# Altium schematic sheet weatherstation.SchDoc: Weather Station
size A4; CheckedBy: rrodrigu; Author: Satxo; CompanyName: Satxo; Revision: 0v1; SheetNumber: 8; SheetTotal: 8; ProjectName: Basestation
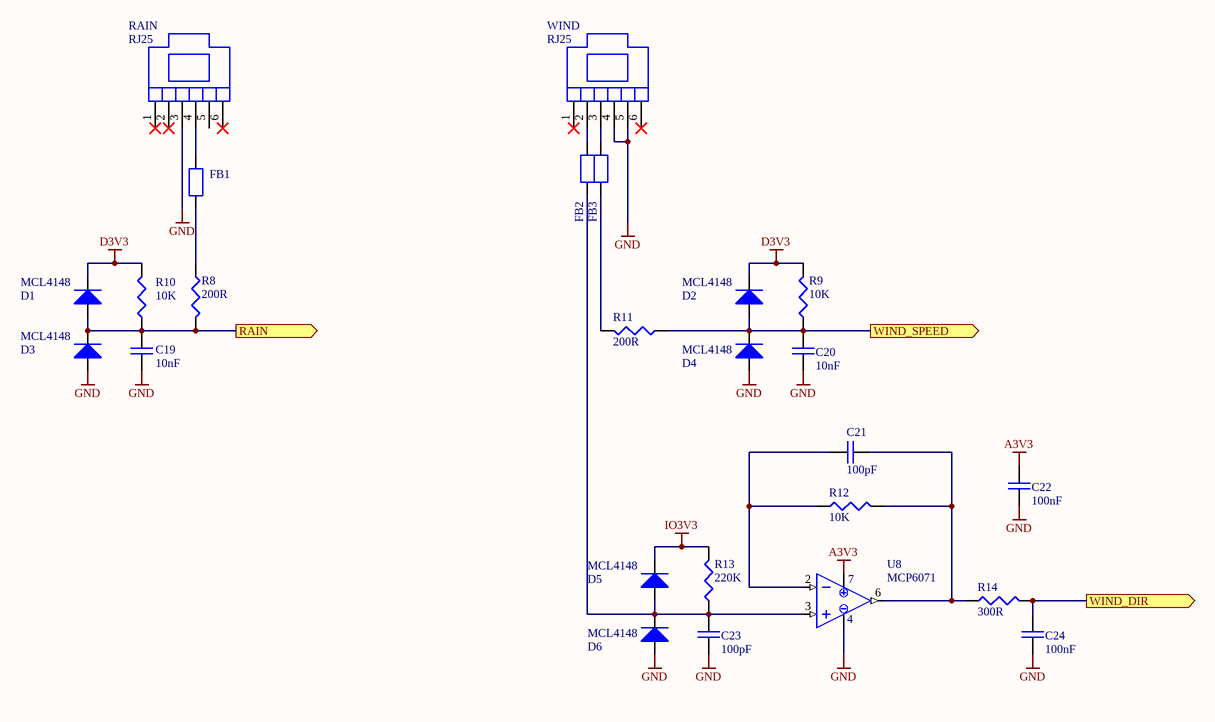
[diagram p0: weatherstation.SchDoc]

## Parts
C19  10nF  [0603]
C20  10nF  [0603]
C21  100pF  [0603]
C22  100nF  [0603]
C23  100pF  [0603]
C24  100nF  [0603]
D1  MCL4148  [0805@DIODE]
D2  MCL4148  [0805@DIODE]
D3  MCL4148  [0805@DIODE]
D4  MCL4148  [0805@DIODE]
D5  MCL4148  [0805@DIODE]
D6  MCL4148  [0805@DIODE]
FB1  150Z_100MHz  [0805]  (value not drawn)
FB2  150Z_100MHz  [0805]  (value not drawn)
FB3  150Z_100MHz  [0805]  (value not drawn)
R8  200R  [0603]
R9  10K  [0603]
R10  10K  [0603]
R11  200R  [0603]
R12  10K  [0603]
R13  220K  [0603]
R14  300R  [0603]
RAIN  RJ25  [RJ25]
U8  MCP6071  [SOIC-8]
WIND  RJ25  [RJ25]

## Ports
RAIN (out), WIND_DIR (out), WIND_SPEED (out)

## Nets
A3V3: C22.2 U8.7(VDD)
D3V3: D1.K D2.K R9.2 R10.2
GND: C19.1 C20.1 C22.1 C23.1 C24.1 D3.A D4.A D6.A RAIN.3 U8.4(VSS) WIND.4 WIND.5
IO3V3: D5.K R13.2
RAIN: C19.2 D1.A D3.K R8.2 R10.1 ; port RAIN
WIND_DIR: C24.2 R14.2 ; port WIND_DIR
WIND_SPEED: C20.2 D2.A D4.K R9.1 R11.1 ; port WIND_SPEED
NetC21_1: C21.1 R12.1 U8.2(INN)
NetC21_2: C21.2 R12.2 R14.1 U8.6(VOUT)
NetC23_2: C23.2 D5.A D6.K FB2.2 R13.1 U8.3(INP)
NetFB1_1: FB1.1 R8.1
NetFB1_2: FB1.2 RAIN.4
NetFB2_1: FB2.1 WIND.2
NetFB3_1: FB3.1 WIND.3
NetFB3_2: FB3.2 R11.2

Not connected (* = marked no-connect by the designer): RAIN 1* 2* 5 6*; WIND 1* 6*

## Notes on the sheet
- Title
- Size:
- Date:
- A4
- Number:
- Time:
- Revision:
- Sheet
- of
- File:

## Library data of the parts
C19-C24 = CAP: Capacitor; Owner: Nuno Brum; Sub-Type: Ceramic; Assembly: INS; Maximum Voltage: *; Creation Date: 2005-04-28; Status: Valid; Validation date: 2006-05-15; Type: Capacitor
D1-D6 = Diode: Vishay Standard Avalanche Sinterglass Diode; Owner: Nuno Brum; Sub-Type: Generic; Assembly: INS; Validation date: 2006-05-15; Creation Date: 2001-06-05; Status: Valid; Model: MCL4148; Type: Diode
FB1-FB3 = FERRITE-BEAD-AXIAL: Ferrite bead; Sub-Type: Filter; Owner: Sergio Pires; Type: Electrical & Mechanical; Assembly: INS; Creation Date: 2005-10-20; Status: New
R8-R14 = RES: Resistor; Owner: Nuno Brum; Sub-Type: Generic; Assembly: INS; Validation date: 2006-05-15; Creation Date: 2002-07-17; Status: Valid; Power: *; Type: Resistor
RAIN WIND = RJ25: RJ25 Connector; Type: Connector; Creation Date: 2012-03-26
U8 = MCP6V26: Low-Offset Opamp; Type: IC; Creation Date: 2012-03-15